# Altium schematic sheet Power_CU Schematic.SchDoc: Title
size A3; SheetTitle: Power Supply Schematic; ApprovalDate: dd/mm/yyyy; PageSetup: Record=PageOptions|CenterHorizontal=True|CenterVertical=True|PrintScale=1.01|XCorrection=1.00|YCorrection=1.00|PrintKind=1|BorderSize=5000000|LeftOffset=0|BottomOffset=0|Orientation=2|PaperLength=1000|PaperWidth=1000|Scale=100|PaperSource=7|PrintQuality=600|MediaType=1|DitherType=10|PaperKind=A3 (297 x 420mm)|PrintScaleMode=1; Title2: Power Schematic; Date: *******; ApprovedBy: *******; CheckedBy: None; Author: *******; CompanyName: *******; DrawnBy: Name; Engineer: *******; Organization: *******; Address1: *******; Address2: *******; Address3: *******; Address4: *******; DocumentNumber: Doc Num; Revision: *******; SheetNumber: 1; SheetTotal: *******; CurrentTime: *******; CurrentDate: *******; Time: *******; DocumentFullPathAndName: *******; DocumentName: *******; ModifiedDate: *******; ImagePath: *******; ProjectName: *******; Application_BuildNumber: *******
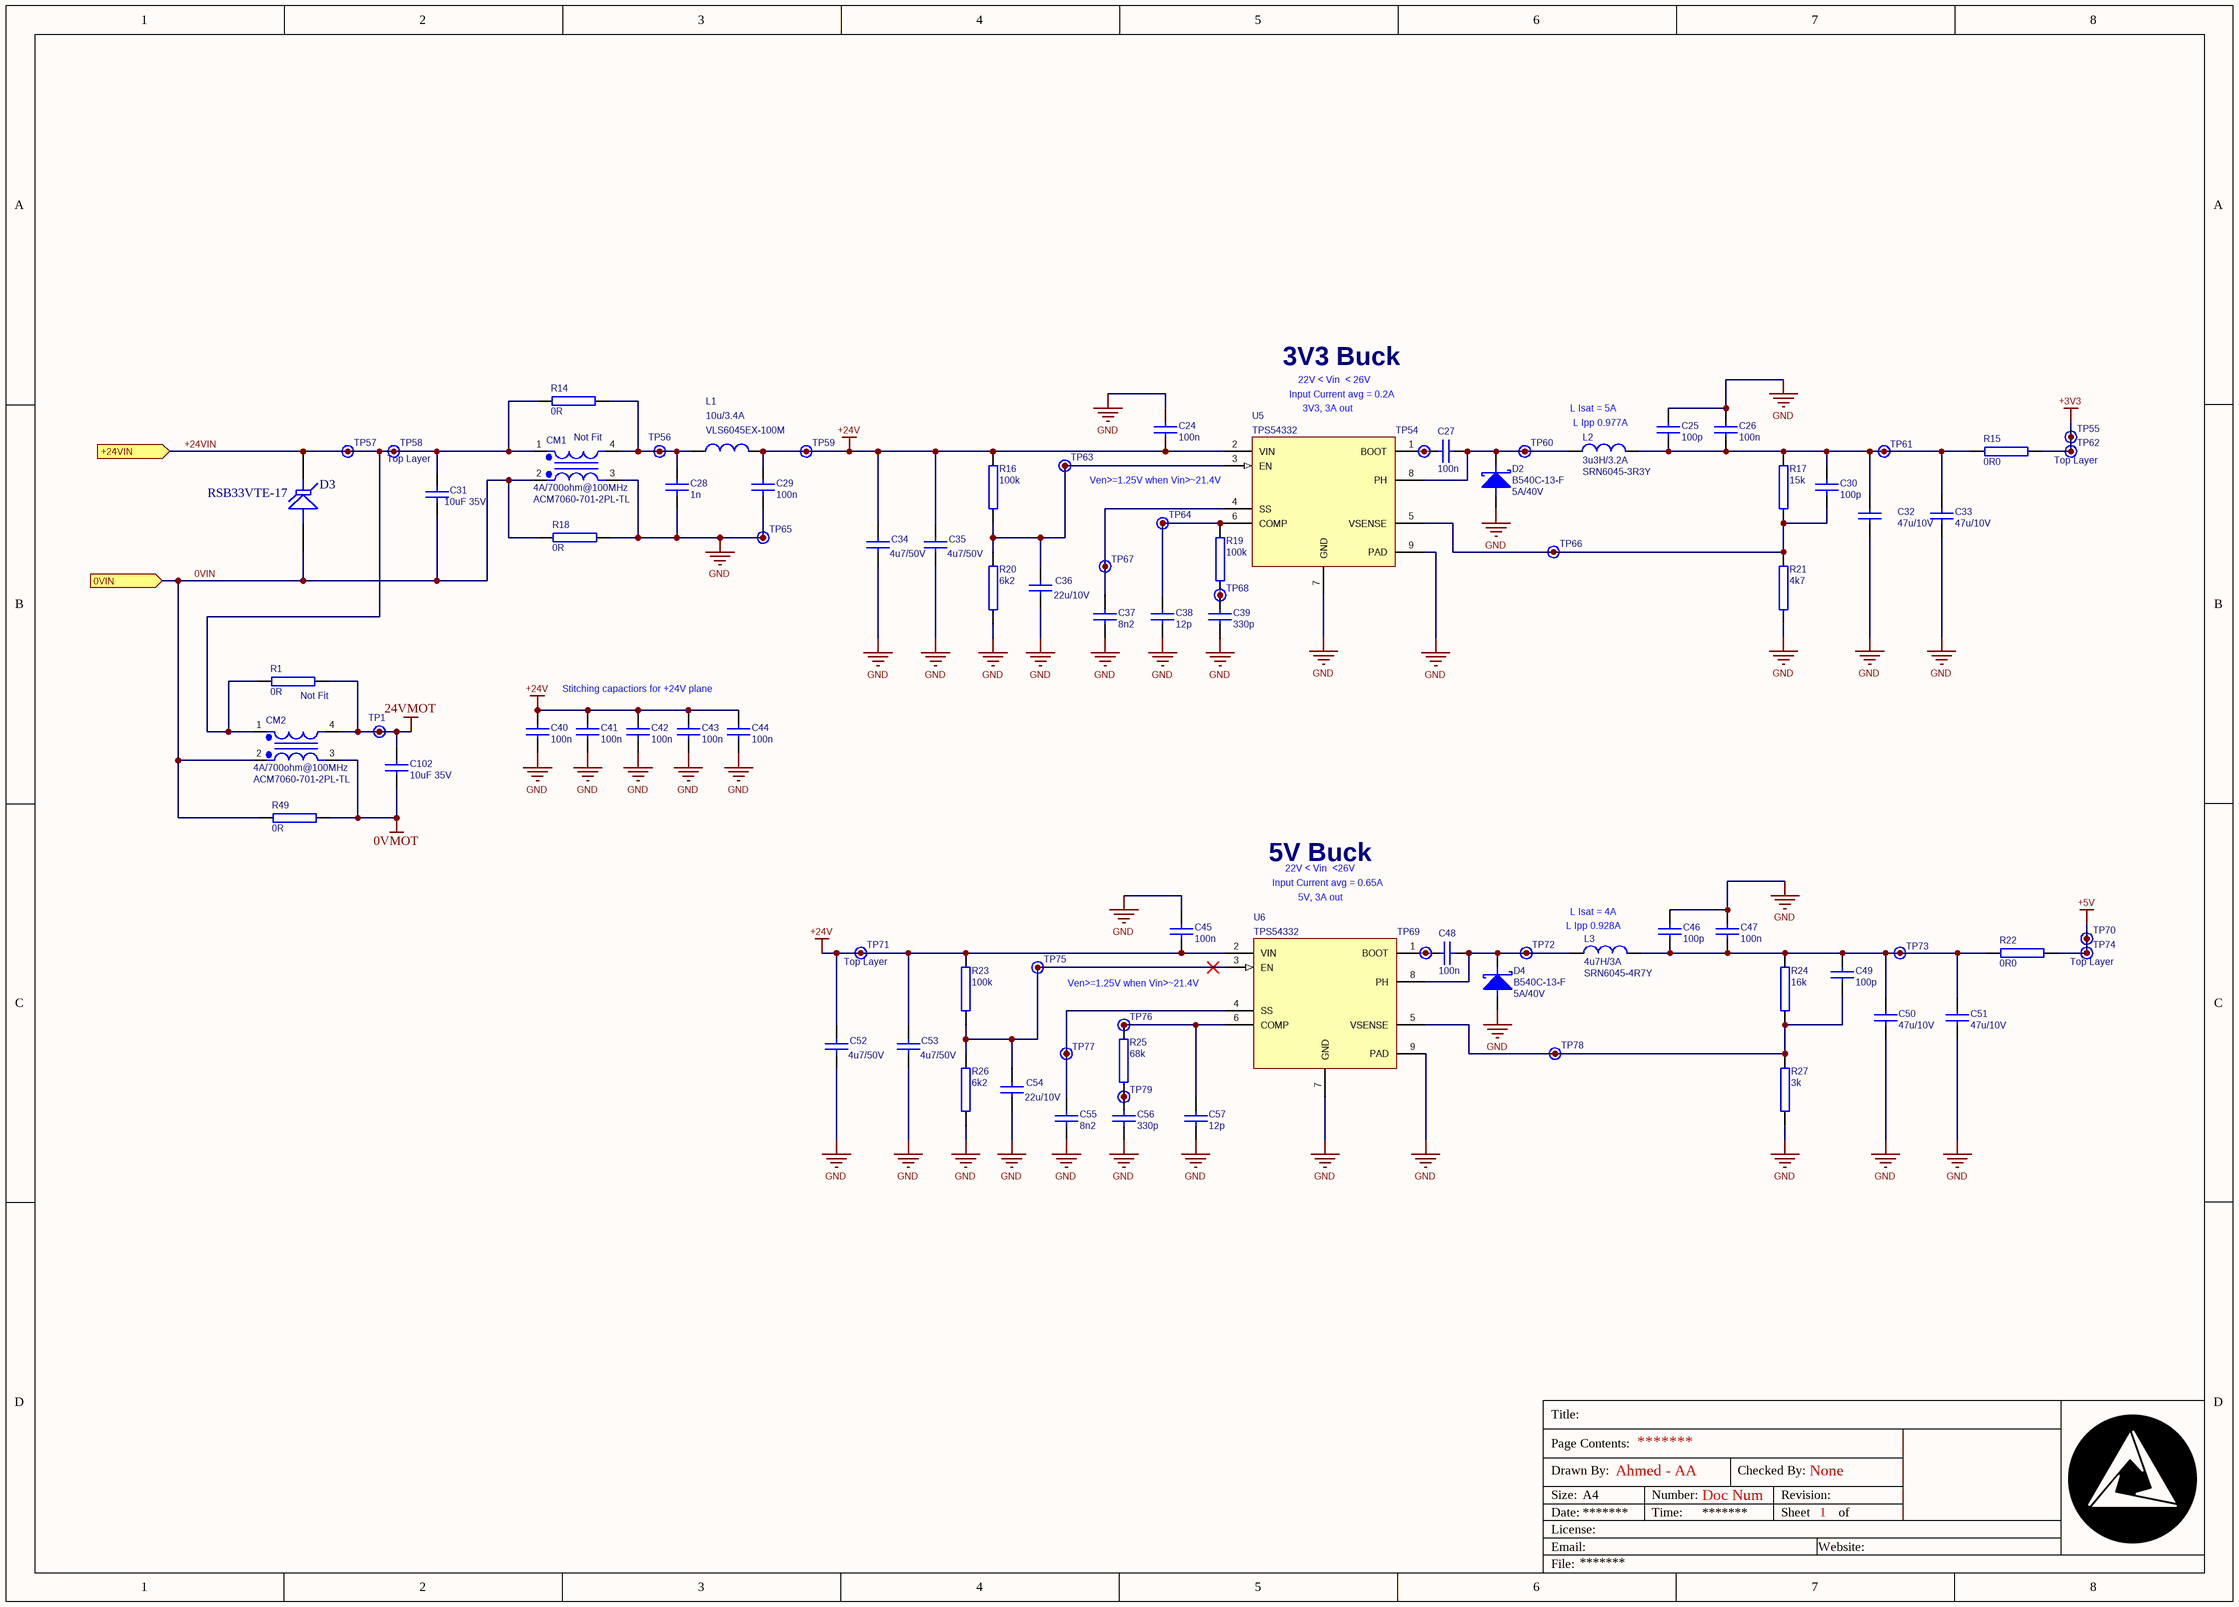
[diagram p0: Power_CU Schematic.SchDoc]

## Parts
C24  100n  [CAPC1608X09N(0603)]
C25  100p  [CAPC1608X09N(0603)]
C26  100n  [CAPC1608X09N(0603)]
C27  100n  [CAPC1608X09N(0603)]
C28  1n  [CAPC1608X09N(0603)]
C29  100n  [CAPC1608X09N(0603)]
C30  100p  [CAPC1608X09N(0603)]
C31  10uF 35V  [CAPC1608X09N(0603)]
C32  47u/10V  [CAPC2012X13N(0805)]
C33  47u/10V  [CAPC2012X13N(0805)]
C34  04 Value: 4u7/50V  [CAPC3216X16N(1206)]  (hidden comment: Cin)
C35  04 Value: 4u7/50V  [CAPC3216X16N(1206)]  (hidden comment: Cin)
C36  22u/10V  [CAPC1608X09N(0603)]
C37  8n2  [CAPC1608X09N(0603)]
C38  12p  [CAPC1608X09N(0603)]
C39  330p  [CAPC1608X09N(0603)]
C40  100n  [CAPC1608X09N(0603)]
C41  100n  [CAPC1608X09N(0603)]
C42  100n  [CAPC1608X09N(0603)]
C43  100n  [CAPC1608X09N(0603)]
C44  100n  [CAPC1608X09N(0603)]
C45  100n  [CAPC1608X09N(0603)]
C46  100p  [CAPC1608X09N(0603)]
C47  100n  [CAPC1608X09N(0603)]
C48  100n  [CAPC1608X09N(0603)]
C49  100p  [CAPC1608X09N(0603)]
C50  47u/10V  [CAPC2012X13N(0805)]
C51  47u/10V  [CAPC2012X13N(0805)]
C52  04 Value: 4u7/50V  [CAPC3216X16N(1206)]  (hidden comment: Cin)
C53  04 Value: 4u7/50V  [CAPC3216X16N(1206)]  (hidden comment: Cin)
C54  22u/10V  [CAPC1608X09N(0603)]
C55  8n2  [CAPC1608X09N(0603)]
C56  330p  [CAPC1608X09N(0603)]
C57  12p  [CAPC1608X09N(0603)]
C102  10uF 35V  [CAPC1608X09N(0603)]
CM1  4A/700ohm@100MHz  07 Assembly Options: Not Fit  [ACM7060-701-2PL-TL]
CM2  4A/700ohm@100MHz  07 Assembly Options: Not Fit  [ACM7060-701-2PL-TL]
D2  B540C-13-F  04 Value: 5A/40V  [B540C]
D3  RSB33VTE-17  [425]
D4  B540C-13-F  04 Value: 5A/40V  [B540C]
L1  10u/3.4A  02 Part Number: VLS6045EX-100M  [VLP6045LT-100M]
L2  3u3H/3.2A  [SRN6045-1R0Y]
L3  4u7H/3A  [SRN6045-1R0Y]
R1  0R  [RESC3116X07N(1206)]
R14  0R  [RESC3116X07N(1206)]
R15  0R0  [RESC1608X06N(0603)]
R16  100k  [RESC1608X06N(0603)]
R17  15k  [RESC1608X06N(0603)]
R18  0R  [RESC3116X07N(1206)]
R19  100k  [RESC1608X06N(0603)]
R20  6k2  [RESC1608X06N(0603)]
R21  4k7  [RESC1608X06N(0603)]
R22  0R0  [RESC1608X06N(0603)]
R23  100k  [RESC1608X06N(0603)]
R24  16k  [RESC1608X06N(0603)]
R25  68k  [RESC1608X06N(0603)]
R26  6k2  [RESC1608X06N(0603)]
R27  3k  [RESC1608X06N(0603)]
R49  0R  [RESC3116X07N(1206)]
TP1  LFX_P  [Test Point 1mm]  (value not drawn)  (no BOM)
TP54  LFX_P  [Test Point 1mm]  (value not drawn)  (no BOM)
TP55  LFX_P  [Test Point 1mm]  (value not drawn)  (no BOM)
TP56  LFX_P  [Test Point 1mm]  (value not drawn)  (no BOM)
TP57  LFX_P  [Test Point 1mm]  (value not drawn)  (no BOM)
TP58  Notes: Top Layer  [Test Point 1mm]  (hidden comment: LFX_P)  (no BOM)
TP59  LFX_P  [Test Point 1mm]  (value not drawn)  (no BOM)
TP60  LFX_P  [Test Point 1mm]  (value not drawn)  (no BOM)
TP61  LFX_P  [Test Point 1mm]  (value not drawn)  (no BOM)
TP62  Notes: Top Layer  [Test Point 1mm]  (hidden comment: LFX_P)  (no BOM)
TP63  LFX_P  [Test Point 1mm]  (value not drawn)  (no BOM)
TP64  LFX_P  [Test Point 1mm]  (value not drawn)  (no BOM)
TP65  LFX_P  [Test Point 1mm]  (value not drawn)  (no BOM)
TP66  LFX_P  [Test Point 1mm]  (value not drawn)  (no BOM)
TP67  LFX_P  [Test Point 1mm]  (value not drawn)  (no BOM)
TP68  LFX_P  [Test Point 1mm]  (value not drawn)  (no BOM)
TP69  LFX_P  [Test Point 1mm]  (value not drawn)  (no BOM)
TP70  LFX_P  [Test Point 1mm]  (value not drawn)  (no BOM)
TP71  Notes: Top Layer  [Test Point 1mm]  (hidden comment: LFX_P)  (no BOM)
TP72  LFX_P  [Test Point 1mm]  (value not drawn)  (no BOM)
TP73  LFX_P  [Test Point 1mm]  (value not drawn)  (no BOM)
TP74  Notes: Top Layer  [Test Point 1mm]  (hidden comment: LFX_P)  (no BOM)
TP75  LFX_P  [Test Point 1mm]  (value not drawn)  (no BOM)
TP76  LFX_P  [Test Point 1mm]  (value not drawn)  (no BOM)
TP77  LFX_P  [Test Point 1mm]  (value not drawn)  (no BOM)
TP78  LFX_P  [Test Point 1mm]  (value not drawn)  (no BOM)
TP79  LFX_P  [Test Point 1mm]  (value not drawn)  (no BOM)
U5  TPS54332  [SOIC127P600X170_HS-9N_b]
U6  TPS54332  [SOIC127P600X170_HS-9N_b]

## Ports
0VIN (in), +24VIN (in)

## Nets
0VMOT: C102.1 CM2.3 R49.2
24VMOT: C102.2 CM2.4 R1.2 TP1.TP
+3V3: R15.2 TP55.TP TP62.TP
+5V: R22.2 TP70.TP TP74.TP
+24V: C24.2 C29.1 C34.2 C35.2 C40.1 C41.1 C42.1 C43.1 C44.1 C45.2 C52.2 C53.2 L1.2 R16.2 R23.2 TP59.TP TP71.TP U5.2(VIN) U6.2(VIN)
GND: C24.1 C25.1 C26.1 C28.1 C29.2 C32.1 C33.1 C34.1 C35.1 C36.1 C37.1 C38.1 C39.1 C40.2 C41.2 C42.2 C43.2 C44.2 C45.1 C46.1 C47.1 C50.1 C51.1 C52.1 C53.1 C54.1 C55.1 C56.1 C57.1 CM1.3 D2.A D4.A R18.2 R20.1 R21.1 R26.1 R27.1 TP65.TP U5.7(GND) U5.9(PAD) U6.7(GND) U6.9(PAD)
0VIN: C31.1 CM1.2 CM2.2 D3.1(A) R18.1 R49.1 ; port 0VIN
+24VIN: C31.2 CM1.1 CM2.1 D3.2(K) R1.1 R14.1 TP57.TP TP58.TP ; port +24VIN
NetC25_2: C25.2 C26.2 C30.1 C32.2 C33.2 L2.2 R15.1 R17.2 TP61.TP
NetC27_1: C27.1 D2.K L2.1 TP60.TP U5.8(PH)
NetC27_2: C27.2 TP54.TP U5.1(BOOT)
NetC28_2: C28.2 CM1.4 L1.1 R14.2 TP56.TP
NetC30_2: C30.2 R17.1 R21.2 TP66.TP U5.5(VSENSE)
NetC36_2: C36.2 R16.1 R20.2 TP63.TP U5.3(EN)
NetC37_2: C37.2 TP67.TP U5.4(SS)
NetC38_2: C38.2 R19.2 TP64.TP U5.6(COMP)
NetC39_2: C39.2 R19.1 TP68.TP
NetC46_2: C46.2 C47.2 C49.1 C50.2 C51.2 L3.2 R22.1 R24.2 TP73.TP
NetC48_1: C48.1 D4.K L3.1 TP72.TP U6.8(PH)
NetC48_2: C48.2 TP69.TP U6.1(BOOT)
NetC49_2: C49.2 R24.1 R27.2 TP78.TP U6.5(VSENSE)
NetC54_2: C54.2 R23.1 R26.2 TP75.TP U6.3(EN)
NetC55_2: C55.2 TP77.TP U6.4(SS)
NetC56_2: C56.2 R25.1 TP79.TP
NetC57_2: C57.2 R25.2 TP76.TP U6.6(COMP)

## Notes on the sheet
- 22V < Vin  < 26V
- 3V3 Buck
- Input Current avg = 0.2A
- Ven>=1.25V when Vin>~21.4V
- (near U5) 3V3, 3A out
- L Isat = 5A
- L Ipp 0.977A
- Stitching capactiors for +24V plane
- 5V Buck
- (near U6) 5V, 3A out
- 22V < Vin  <26V
- Input Current avg = 0.65A
- L Isat = 4A
- (near L3) L Ipp 0.928A
- Title:
- Drawn By:
- Page Contents:
- Ahmed - AA
- Checked By:
- Size:
- Date:
- File:
- License:
- Email:
- A4
- Number:
- Time:
- Revision:
- Sheet
- Website:
- of

## Library data of the parts
C24 C26 C27 C29 C40-C45 C47 C48 = GRM188R71H104KA93D: Capacitor, Ceramic, 50V, ±10%, X7R, -55°C to 125°C; 08 Manufacturer: Murata Electronics North America; 06 Package: 0603; 12 Author: D.Grace; 05 Footprint Type: SMD; 02 Part Number: GRM188R71H104KA93D; 03 Description: Capacitor, Ceramic, 50V, ±10%, X7R, -55°C to 125°C; 04 Value: 100n; 01 Part Category: Capacitor; 09 Digikey PN: 490-1519-2-ND; ComponentLink1Description: Datasheet; ComponentLink1URL: L:\Datasheet\Capacitor\c02e.pdf
C25 C30 C46 C49 = GRM1885C1H101JA01D: Capacitor, Ceramic, 50V, ±5%, C0G NP0, -55°C to 125°C; 08 Manufacturer: Murata Electronics North America; 06 Package: 0603; 12 Author: D.Grace; 05 Footprint Type: SMD; 02 Part Number: GRM1885C1H101JA01D; 03 Description: Capacitor, Ceramic, 50V, ±5%, C0G NP0, -55°C to 125°C; 04 Value: 100p; 01 Part Category: Capacitor; 09 Digikey PN: 490-1427-2-ND; 10 Alternate Supplier: Mouser; 11 Alternate Supplier PN: 81-GRM39C101J50; ComponentLink1Description: Datasheet; ComponentLink1URL: L:\Datasheet\Capacitor\c02e.pdf
C28 = GRM1885C1H102JA01D: Capacitor, Ceramic, 50V, ±5%, C0G NP0, -55°C to 125°C; 08 Manufacturer: Murata Electronics North America; 06 Package: 0603; 12 Author: D.Grace; 05 Footprint Type: SMD; 02 Part Number: GRM1885C1H102JA01D; 03 Description: Capacitor, Ceramic, 50V, ±5%, C0G NP0, -55°C to 125°C; 04 Value: 1n; 01 Part Category: Capacitor; 09 Digikey PN: 490-1451-2-ND; ComponentLink1Description: Datasheet; ComponentLink1URL: L:\Datasheet\Capacitor\c02e.pdf
C31 = GRM1885C1H102JA01D: Capacitor, Ceramic, 50V, ±20%,; 06 Package: 0603; 12 Author: D.Grace; 05 Footprint Type: SMD; 02 Part Number: GRM1885C1H102JA01D; 03 Description: Capacitor, Ceramic, 50V, ±20%; 04 Value: 10uF; 01 Part Category: Capacitor; ComponentLink1Description: Datasheet
C32 C33 C50 C51 = C2012X5R1A476M125AC: Capacitor, Ceramic, 10V, ±20%, X5R, -55°C to 85°C; 08 Manufacturer: TDK; 04 Value: 47u; 06 Package: 0805; 12 Author: K.Sukumar; 05 Footprint Type: SMD; 02 Part Number: C2012X5R1A476M125AC; 03 Description: Capacitor, Ceramic, 10V, ±20%, X5R, -55°C to 85°C; 01 Part Category: Capacitor; 09 Digikey PN: 445-8239-2-ND; ComponentLink1Description: Datasheet; ComponentLink1URL: L:\Datasheet\Capacitor\mlcc_commercial_general_en.pdf
C34 C35 C52 C53 = GRM31CR71H475KA12L: Capacitor, Ceramic, 50V, ±10%, X7R, -55°C to 125°C; 08 Manufacturer: Murata Electronics North America; 06 Package: 1206; 12 Author: D.Grace; 05 Footprint Type: SMD; 02 Part Number: GRM31CR71H475KA12L; 03 Description: Capacitor, Ceramic, 50V, ±10%, X7R, -55°C to 125°C; 01 Part Category: Capacitor; 09 Digikey PN: 490-6521-2-ND; ComponentLink1Description: Datasheet; ComponentLink1URL: L:\Datasheet\Capacitor\c02e.pdf
C36 C54 = C1608X5R1A226M080AC: Capacitor, Ceramic, 10V, ±20%, X5R, -55°C to 85°C; 08 Manufacturer: TDK Corporation; 04 Value: 22u; 06 Package: 0603; 12 Author: K.Sukumar; 05 Footprint Type: SMD; 02 Part Number: C1608X5R1A226M080AC; 03 Description: Capacitor, Ceramic, 10V, ±20%, X5R, -55°C to 85°C; 01 Part Category: Capacitor; 09 Digikey PN: 445-9077-2-ND; ComponentLink1Description: Datasheet; ComponentLink1URL: L:\Datasheet\Capacitor\mlcc_commercial_general_en.pdf
C37 C55 = GRM188R71H822KA01D: Capacitor, Ceramic, 50V, ±10%, X7R, -55°C to 125°C; 08 Manufacturer: Murata Electronics North America; 06 Package: 0603; 12 Author: D.Grace; 05 Footprint Type: SMD; 02 Part Number: GRM188R71H822KA01D; 03 Description: Capacitor, Ceramic, 50V, ±10%, X7R, -55°C to 125°C; 04 Value: 8n2; 01 Part Category: Capacitor; 09 Digikey PN: 490-1510-2-ND; 10 Alternate Supplier: Mouser; 11 Alternate Supplier PN: 81-GRM39X822K50D; ComponentLink1Description: Datasheet; ComponentLink1URL: L:\Datasheet\Capacitor\c02e.pdf
C38 C57 = GRM1885C1H120JA01D: Capacitor, Ceramic, 50V, ±5%, C0G NP0, -55°C to 125°C; 08 Manufacturer: Murata Electronics North America; 06 Package: 0603; 12 Author: D.Grace; 05 Footprint Type: SMD; 02 Part Number: GRM1885C1H120JA01D; 03 Description: Capacitor, Ceramic, 50V, ±5%, C0G NP0, -55°C to 125°C; 04 Value: 12p; 01 Part Category: Capacitor; 09 Digikey PN: 490-1405-2-ND; 10 Alternate Supplier: Mouser; 11 Alternate Supplier PN: 81-GRM39C120J50; ComponentLink1Description: Datasheet; ComponentLink1URL: L:\Datasheet\Capacitor\c02e.pdf
C39 C56 = GRM188R71H331KA01D: Capacitor, Ceramic, 50V, ±10%, X7R, -55°C to 125°C; 08 Manufacturer: Murata Electronics North America; 06 Package: 0603; 12 Author: M.Fineschi; 05 Footprint Type: SMD; 02 Part Number: GRM188R71H331KA01D; 03 Description: Capacitor, Ceramic, 50V, ±10%, X7R, -55°C to 125°C; 04 Value: 330p; 01 Part Category: Capacitor; 09 Digikey PN: 490-1486-1-ND; ComponentLink1Description: Datasheet; ComponentLink1URL: L:\Datasheet\Capacitor\c02e.pdf
C102 = GRM1885C1H102JA01D: Capacitor, Ceramic, 50V, ±5%, C0G NP0, -55°C to 125°C; 03 Description: Capacitor, Ceramic, 35V, ±20%; 06 Package: 0603; 05 Footprint Type: SMD; 04 Value: 10uF 35V; 01 Part Category: Capacitor; ComponentLink1Description: Datasheet
CM1 CM2 = ACM7060-701-2PL-TL: Common Mode Choke, 4A, 500ohm min 700ohm typ @100MHz, 15mOhm Max,; 01 Part Category: Filter; 08 Manufacturer: TDK Corporation; 06 Package: 7x6x3.5mm; 05 Footprint Type: SMD; 12 Author: D.Grace; 03 Description: Common Mode Choke, 4A, 500ohm min 700ohm typ @100MHz, 15mOhm Max,; 04 Value: 700ohm@100MHz; ComponentLink1Description: Datasheet; ComponentLink1URL: L:\Datasheet\Filter\ACM Series.pdf; 02 Part Number: ACM7060-701-2PL-TL; 09 Digikey PN: 445-2215-2-ND
D2 D4 = B540C-13-F: Diode, Schottky, Fast Recovery, 550mV @ 5A, 40V, 5A,  500ns, -55°C - +125°C; 01 Part Category: Protection; 08 Manufacturer: Diodes Inc; 06 Package: SMC; 05 Footprint Type: SMD; 12 Author: J.McLachlan; 03 Description: Diode, Schottky, Fast Recovery, 550mV @ 5A, 40V, 5A,  500ns, -55°C - +125°C; ComponentLink1Description: Datasheet; ComponentLink1URL: L:\Datasheet\Protection\ds13012.pdf; 09 Digikey PN: B540C-FDITR-ND; 02 Part Number: B540C-13-F
D3 = Tranzorb: Transient Voltage Suppression (TVS) Diode; Published: 24-Mar-1999; LatestRevisionDate: 17-Jul-2002; LatestRevisionNote: Re-released for DXP Platform.; PackageReference: DO-7; Publisher: Altium Limited; PackageDescription: Axial Lead Diode
L1 = VLP6045LT-100M: Inductor, 10µH , 3.4A rated, 3.9A Saturation,61mOhm; 08 Manufacturer: TDK Corporation; 04 Value: 10uH; 06 Package: Custom; 05 Footprint Type: SMD; 12 Author: M.Fineschi; 03 Description: Inductor, 10µH , 3.4A rated, 3.9A Saturation, 61mOhm; 01 Part Category: Inductor; ComponentLink1Description: Datasheet; ComponentLink1URL: https://product.tdk.com/info/en/catalog/datasheets/inductor_commercial_power_vls6045ex_en.pdf; 09 Digikey PN: 445-173039-1-ND
L2 = SRN6045-3R3Y: Inductor, 3u3H , I = 3.2A, 30.2mOhm, SRF 27MHz, ±30%, 5A Saturation; 01 Part Category: Passive; 08 Manufacturer: Bourns Inc; 06 Package: 6mm x 6mm; 05 Footprint Type: SMD; 12 Author: J.McLachlan; 03 Description: Inductor, 3u3H , I = 3.2A, 30.2mOhm, SRF 27MHz, ±30%, 5A Saturation; 04 Value: 3u3H; ComponentLink1Description: Datasheet; ComponentLink1URL: L:\Datasheet\Inductor\SRN6045.pdf; 09 Digikey PN: SRN6045-3R3YTR-ND; 02 Part Number: SRN6045-3R3Y
L3 = SRN6045-4R7Y: Inductor, 4u7H , I = 3A, 37.6mOhm, SRF 22MHz, ±30%, 4A Saturation; 01 Part Category: Passive; 08 Manufacturer: Bourns Inc; 06 Package: 6mm x 6mm; 05 Footprint Type: SMD; 12 Author: J.McLachlan; 03 Description: Inductor, 4u7H , I = 3A, 37.6mOhm, SRF 22MHz, ±30%, 4A Saturation; 04 Value: 4u7H; ComponentLink1Description: Datasheet; ComponentLink1URL: L:\Datasheet\Inductor\SRN6045.pdf; 09 Digikey PN: SRN6045-4R7YTR-ND; 02 Part Number: SRN6045-4R7Y
R1 R14 R18 R49 = RC1206JR-070RL: Resistor, Thick Film, 0.25W, ±1%, ±100ppm/°C; 08 Manufacturer: Yageo; 06 Package: 1206; 12 Author: M.Fineschi; 05 Footprint Type: SMD; 03 Description: Resistor, Thick Film, 0.25W, ±1%, ±100ppm/°C; 04 Value: 0R; 09 Digikey PN: 311-0.0ERTR-ND; 01 Part Category: Resistor; ComponentLink1Description: Datasheet; ComponentLink1URL: L:\Datasheet\Resistor\PYu-RC1206_51_RoHS_L-4.pdf; 02 Part Number: RC1206JR-070RL
R15 R22 = RC1608J000CS: Resistor, Thick Film, 0.1W, ±1%, ±100ppm/°C; 08 Manufacturer: Samsung Electro-Mechanics; 13 Reviewed By: P.Moutzouris; 06 Package: 0603; 12 Author: K.Sukumar; 05 Footprint Type: SMD; 02 Part Number: RC1608J000CS; 03 Description: Resistor, Thick Film, 0.1W, ±1%, ±100ppm/°C; 04 Value: 0R0; 09 Digikey PN: 1276-3510-2-ND; 01 Part Category: Resistor; ComponentLink1Description: Datasheet; ComponentLink1URL: L:\Datasheet\Resistor\Chip_Resistor.pdf
R16 R19 R23 = RC0603FR-07100KL: Resistor, Thick Film, 0.1W, ±1%, ±100ppm/°C; 08 Manufacturer: Yageo; 13 Reviewed By: P.Moutzouris; 06 Package: 0603; 12 Author: D.Grace; 05 Footprint Type: SMD; 02 Part Number: RC0603FR-07100KL; 03 Description: Resistor, Thick Film, 0.1W, ±1%, ±100ppm/°C; 04 Value: 100k; 01 Part Category: Resistor; ComponentLink1Description: Datasheet; ComponentLink1URL: L:\Datasheet\Resistor\PYu-RC0603_51_RoHS_L_4.pdf
  R16 R23: 09 Digikey PN: P100KLCT-ND
  R19: 09 Digikey PN: 311-100KHRTR-ND
R17 = RC0603FR-0715KL: Resistor, Thick Film, 0.1W, ±1%, ±100ppm/°C; 08 Manufacturer: Yageo; 13 Reviewed By: P.Moutzouris; 06 Package: 0603; 12 Author: D.Grace; 05 Footprint Type: SMD; 02 Part Number: RC0603FR-0715KL; 03 Description: Resistor, Thick Film, 0.1W, ±1%, ±100ppm/°C; 04 Value: 15k; 09 Digikey PN: 311-15.0KHRTR-ND; 01 Part Category: Resistor; ComponentLink1Description: Datasheet; ComponentLink1URL: L:\Datasheet\Resistor\PYu-RC0603_51_RoHS_L_4.pdf
R20 R26 = RC0603FR-076K2L: Resistor, Thick Film, 0.1W, ±1%, ±100ppm/°C; 08 Manufacturer: Yageo; 13 Reviewed By: P.Moutzouris; 06 Package: 0603; 12 Author: D.Grace; 05 Footprint Type: SMD; 02 Part Number: RC0603FR-076K2L; 03 Description: Resistor, Thick Film, 0.1W, ±1%, ±100ppm/°C; 04 Value: 6k2; 09 Digikey PN: 311-6.20KHRTR-ND; 01 Part Category: Resistor; ComponentLink1Description: Datasheet; ComponentLink1URL: L:\Datasheet\Resistor\PYu-RC0603_51_RoHS_L_4.pdf
R21 = RC0603FR-074K7L: Resistor, Thick Film, 0.1W, ±1%, ±100ppm/°C; 08 Manufacturer: Yageo; 13 Reviewed By: P.Moutzouris; 06 Package: 0603; 12 Author: D.Grace; 05 Footprint Type: SMD; 02 Part Number: RC0603FR-074K7L; 03 Description: Resistor, Thick Film, 0.1W, ±1%, ±100ppm/°C; 04 Value: 4k7; 09 Digikey PN: 311-4.70KHRTR-ND; 01 Part Category: Resistor; ComponentLink1Description: Datasheet; ComponentLink1URL: L:\Datasheet\Resistor\PYu-RC0603_51_RoHS_L_4.pdf
R24 = RC0603FR-0716KL: Resistor, Thick Film, 0.1W, ±1%, ±100ppm/°C; 08 Manufacturer: Yageo; 13 Reviewed By: P.Moutzouris; 06 Package: 0603; 12 Author: D.Grace; 05 Footprint Type: SMD; 02 Part Number: RC0603FR-0716KL; 03 Description: Resistor, Thick Film, 0.1W, ±1%, ±100ppm/°C; 04 Value: 16k; 09 Digikey PN: 311-16.0KHRTR-ND; 01 Part Category: Resistor; ComponentLink1Description: Datasheet; ComponentLink1URL: L:\Datasheet\Resistor\PYu-RC0603_51_RoHS_L_4.pdf
R25 = RC0603FR-0768KL: Resistor, Thick Film, 0.1W, ±1%, ±100ppm/°C; 08 Manufacturer: Yageo; 13 Reviewed By: P.Moutzouris; 06 Package: 0603; 12 Author: D.Grace; 05 Footprint Type: SMD; 02 Part Number: RC0603FR-0768KL; 03 Description: Resistor, Thick Film, 0.1W, ±1%, ±100ppm/°C; 04 Value: 68k; 09 Digikey PN: 311-68.0KHRTR-ND; 01 Part Category: Resistor; ComponentLink1Description: Datasheet; ComponentLink1URL: L:\Datasheet\Resistor\PYu-RC0603_51_RoHS_L_4.pdf
R27 = RC0603FR-073KL: Resistor, Thick Film, 0.1W, ±1%, ±100ppm/°C; 08 Manufacturer: Yageo; 13 Reviewed By: P.Moutzouris; 06 Package: 0603; 12 Author: D.Grace; 05 Footprint Type: SMD; 02 Part Number: RC0603FR-073KL; 03 Description: Resistor, Thick Film, 0.1W, ±1%, ±100ppm/°C; 04 Value: 3k; 09 Digikey PN: 311-3.00KHRTR-ND; 01 Part Category: Resistor; ComponentLink1Description: Datasheet; ComponentLink1URL: L:\Datasheet\Resistor\PYu-RC0603_51_RoHS_L_4.pdf
TP1 TP54-TP79 = Test Point: 01 Part Category: PCB; 12 Author: D.Grace
U5 U6 = TPS54332: Step Down, Adjustable, Vomin = 0.8V, Vin = 3.5 - 28V, Fs = 1MHz, Io = 3.5A, -40  ~ 125C; 01 Part Category: IC; 08 Manufacturer: Texas Instruments; 06 Package: 8 SOIC; 05 Footprint Type: SMD; 12 Author: M.Fineschi; 02 Part Number: TPS54332; 03 Description: Step Down, Adjustable, Vomin = 0.8V, Vin = 3.5 - 28V, Fs = 1MHz, Io = 3.5A, -40  ~ 125C; 04 Value: TPS54332; ComponentLink1Description: Datasheet; ComponentLink1URL: L:\Datasheet\IC\tps54332.pdf; 09 Digikey PN: 296-24141-5-ND